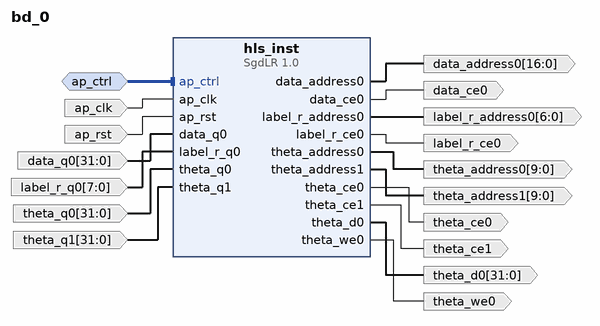
[diagram p0: block diagram of the top level]
# Vivado block design bd_0, xc7z020clg400-1, Vivado 2023.2
create_bd_design bd_0

create_bd_intf_port -mode Slave -vlnv xilinx.com:interface:acc_handshake_rtl:1.0 ap_ctrl
create_bd_port -dir I -type clk ap_clk
set_property -dict {CONFIG.FREQ_HZ 200000000.0} [get_bd_ports ap_clk]
create_bd_port -dir I -type rst ap_rst
set_property -dict {CONFIG.POLARITY ACTIVE_HIGH} [get_bd_ports ap_rst]
create_bd_port -dir O -from 16 -to 0 -type data data_address0
create_bd_port -dir O data_ce0
create_bd_port -dir I -from 31 -to 0 -type data data_q0
create_bd_port -dir O -from 6 -to 0 -type data label_r_address0
create_bd_port -dir O label_r_ce0
create_bd_port -dir I -from 7 -to 0 -type data label_r_q0
create_bd_port -dir O -from 9 -to 0 -type data theta_address0
create_bd_port -dir O -from 9 -to 0 -type data theta_address1
create_bd_port -dir O theta_ce0
create_bd_port -dir O theta_ce1
create_bd_port -dir O -from 31 -to 0 -type data theta_d0
create_bd_port -dir I -from 31 -to 0 -type data theta_q0
create_bd_port -dir I -from 31 -to 0 -type data theta_q1
create_bd_port -dir O theta_we0

create_bd_cell -type ip -vlnv xilinx.com:hls:SgdLR:1.0 hls_inst

# ---- connections ----

connect_bd_intf_net -intf_net ap_ctrl_0_1 [get_bd_intf_ports ap_ctrl] [get_bd_intf_pins hls_inst/ap_ctrl]
connect_bd_net -net ap_clk_0_1 [get_bd_ports ap_clk] [get_bd_pins hls_inst/ap_clk]
connect_bd_net -net ap_rst_0_1 [get_bd_ports ap_rst] [get_bd_pins hls_inst/ap_rst]
connect_bd_net -net data_q0_0_1 [get_bd_ports data_q0] [get_bd_pins hls_inst/data_q0]
connect_bd_net [get_bd_pins hls_inst/data_address0] [get_bd_ports data_address0]
connect_bd_net [get_bd_pins hls_inst/data_ce0] [get_bd_ports data_ce0]
connect_bd_net [get_bd_pins hls_inst/label_r_address0] [get_bd_ports label_r_address0]
connect_bd_net [get_bd_pins hls_inst/label_r_ce0] [get_bd_ports label_r_ce0]
connect_bd_net [get_bd_pins hls_inst/theta_address0] [get_bd_ports theta_address0]
connect_bd_net [get_bd_pins hls_inst/theta_address1] [get_bd_ports theta_address1]
connect_bd_net [get_bd_pins hls_inst/theta_ce0] [get_bd_ports theta_ce0]
connect_bd_net [get_bd_pins hls_inst/theta_ce1] [get_bd_ports theta_ce1]
connect_bd_net [get_bd_pins hls_inst/theta_d0] [get_bd_ports theta_d0]
connect_bd_net [get_bd_pins hls_inst/theta_we0] [get_bd_ports theta_we0]
connect_bd_net -net label_r_q0_0_1 [get_bd_ports label_r_q0] [get_bd_pins hls_inst/label_r_q0]
connect_bd_net -net theta_q0_0_1 [get_bd_ports theta_q0] [get_bd_pins hls_inst/theta_q0]
connect_bd_net -net theta_q1_0_1 [get_bd_ports theta_q1] [get_bd_pins hls_inst/theta_q1]

validate_bd_design
save_bd_design
